# EAGLE design Saldatore (EAGLE 9.5.1)
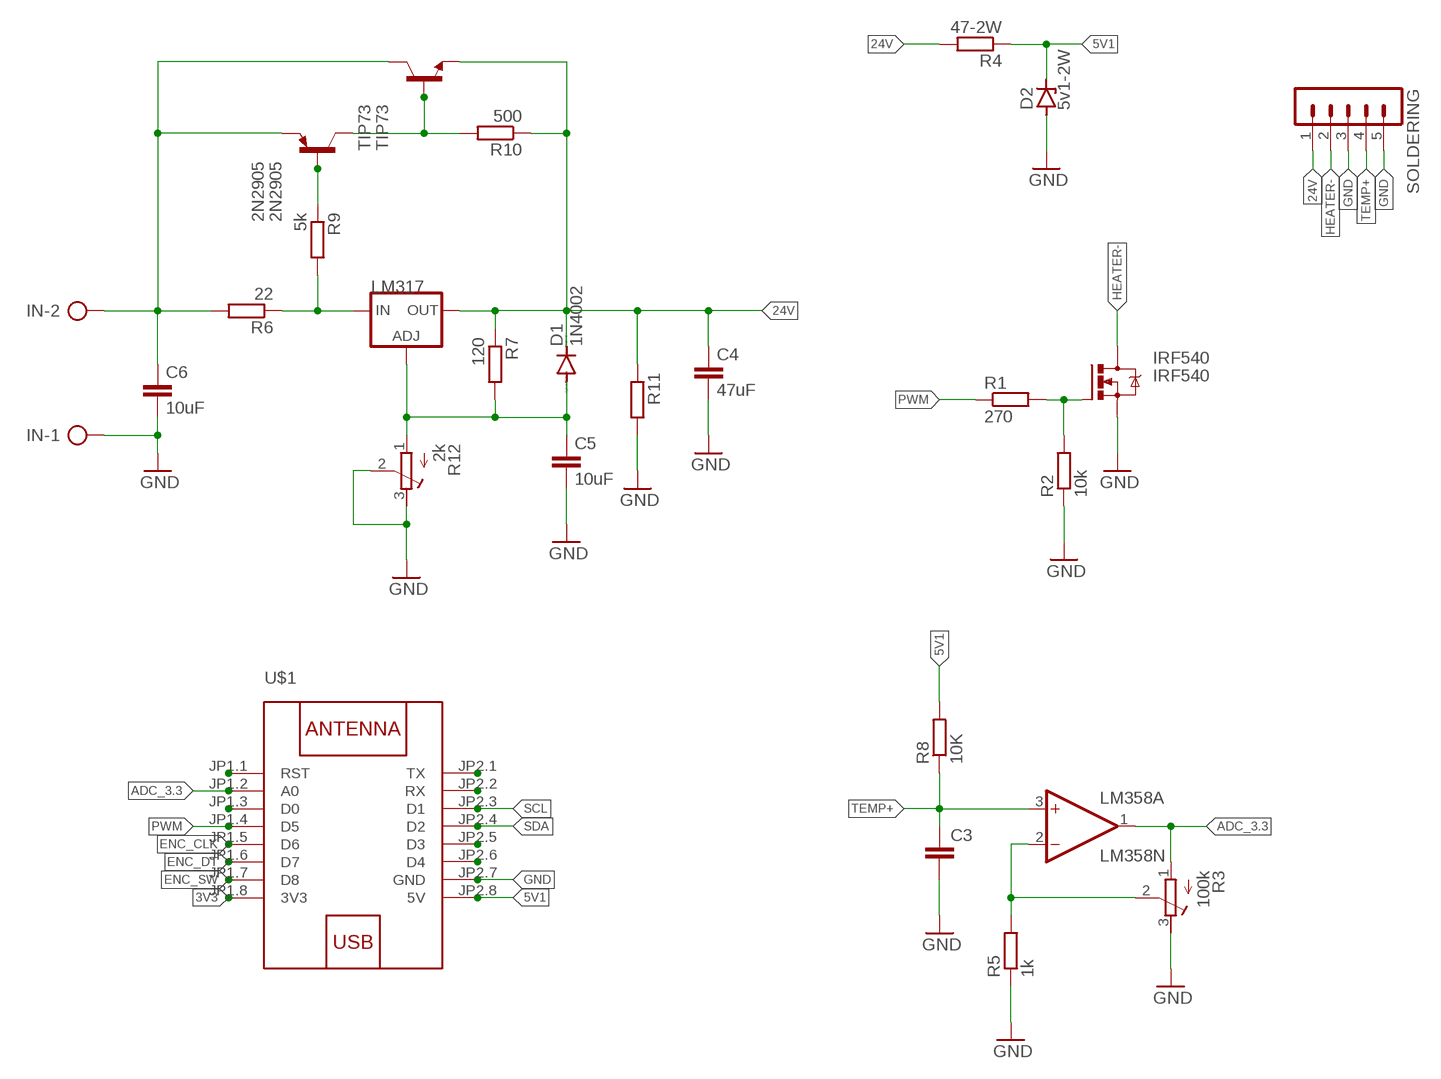
[diagram p0: schematic, sheet 1]

## Parts
2N2905  2N2905  [TO39]
C3  C-EU025-025X050  [C025-025X050]
C4  47uF  C-EU025-025X050  [C025-025X050]
C5  10uF  C-EU025-025X050  [C025-025X050]
C6  10uF  C-EU025-025X050  [C025-025X050]
D1  1N4002  1N4004DO-41  [DIOAD860W70L460D235B]
D2  5v1-2W  ZENER-DIODEDO41Z10  [DO41Z10]
IN  SMKDSP_1,5/2  [SMKDSP_1,5/2]
IRF540  IRF540  [TO220BV]
LM317  LM317TS317TS_TO220  [TO220V]
LM358  LM358N  [DIL08]
R1  270  R-EU_0204/7  [0204/7]
R2  10k  R-EU_0204/7  [0204/7]
R3  100k  R-TRIMM64W  [RTRIM64W]
R4  47-2W  R-EU_0204/7  [0204/7]
R5  1k  R-EU_0204/7  [0204/7]
R6  22  R-EU_0204/7  [0204/7]
R7  120  R-EU_0204/7  [0204/7]
R8  10K  R-EU_0204/7  [0204/7]
R9  5k  R-EU_0204/7  [0204/7]
R10  500  R-EU_0204/7  [0204/7]
R11  R-EU_0204/7  [0204/7]
R12  2k  R-TRIMM64W  [RTRIM64W]
SOLDERING  MA05-1  [MA05-1]
TIP73  TIP73  2N1613  [TO5]
U$1  WEMOS-D1-MINI  [WEMOS-D1-MINI]

## Nets
3V3: U$1.JP1.8(3V3)
5V1: D2.C R4.1 R8.2 U$1.JP2.8(5V)
24V: C4.1 D1.1(C) LM317.2(OUT) R4.2 R7.1 R10.1 R11.1 SOLDERING.1 TIP73.1(E)
ADC_3.3: LM358.1(A:OUT) R3.1(A) U$1.JP1.2(A0)
ENC_CLK: U$1.JP1.5(D6)
ENC_DT: U$1.JP1.6(D7)
ENC_SW: U$1.JP1.7(D8)
GND: C3.2 C4.2 C5.2 C6.2 D2.A IN.1 IRF540.S R2.1 R3.3(E) R5.1 R11.2 R12.2(S) R12.3(E) SOLDERING.3 SOLDERING.5 U$1.JP2.7(GND)
HEATER-: IRF540.D SOLDERING.2
N$1: IRF540.G R1.2 R2.2
N$3: LM358.2(A:-IN) R3.2(S) R5.2
N$5: LM317.3(IN) R6.1 R9.2
N$6: 2N2905.2(B) R9.1
N$7: 2N2905.3(C) R10.2 TIP73.2(B)
N$8: 2N2905.1(E) C6.1 IN.2 R6.2 TIP73.3(C)
N$9: C5.1 D1.2(A) LM317.1(ADJ) R7.2 R12.1(A)
N$11: U$1.JP2.6(D4)
N$12: U$1.JP2.5(D3)
N$15: U$1.JP2.2(RX)
N$16: U$1.JP2.1(TX)
N$17: U$1.JP1.1(RST)
N$19: U$1.JP1.3(D0)
PWM: R1.1 U$1.JP1.4(D5)
SCL: U$1.JP2.3(D1)
SDA: U$1.JP2.4(D2)
TEMP+: C3.1 LM358.3(A:+IN) R8.1 SOLDERING.4
Unconnected: LM358.5(B:+IN) LM358.6(B:-IN) LM358.7(B:OUT)

## Power pins joined to a net without a drawn wire
V+: LM358.8(P:V+)
V-: LM358.4(P:V-)

## Library data of the parts
2N2905 = transistor-pnp:2N2905*: PNP Transistror
C3-C6 = rcl:C-EU: CAPACITOR, European symbol; SPICEPREFIX: C
D1 = diode_MOD:1N4004: DIODE general purpose rectifier, 1 A
D2 = diode_MOD:ZENER-DIODE: Z-Diode
IN = con-phoenix-smkdsp:SMKDSP_1,5/2: Printklemme, Nennstrom: 17,5 A, Bemessungsspannung: 250 V, Raster: 5,0 mm Source: http://eshop.phoenixcontact.de .. 1733415.pdf; MF: FARNELL; MPN: 1733570; OC_FARNELL: 3041244; OC_NEWARK: 69C8588
IRF540 = transistor-power:IRF540: HEXFET Power MOSFET
LM317 = v-reg:LM317TS: VOLTAGE REGULATOR
LM358 = linear:LM358: OP AMP also LM158; LM258; LM2904 Source: http://cache.national.com/ds/LM/LM158.pdf
R1 R2 R4-R11 = rcl:R-EU_: RESISTOR, European symbol; SPICEPREFIX: R
R3 R12 = rcl:R-TRIMM: Trimm resistor; SPICEMODEL: X; SPICEPREFIXL: POT
SOLDERING = con-lstb:MA05-1: PIN HEADER; OC_FARNELL: unknown; OC_NEWARK: unknown
TIP73 = transistor:2N1613: NPN TRANSISTOR
U$1 = diy-modules:WEMOS-D1-MINI: WEMOS D1 mini: Mini Wi-Fi Board based on ESP-8266 device More details can be found here: https://www.wemos.cc/product/d1-mini.html Click here to find device on ebay.com <http://www.ebay.com/sch/wemos+d1+mini+nodemcu>

## Board
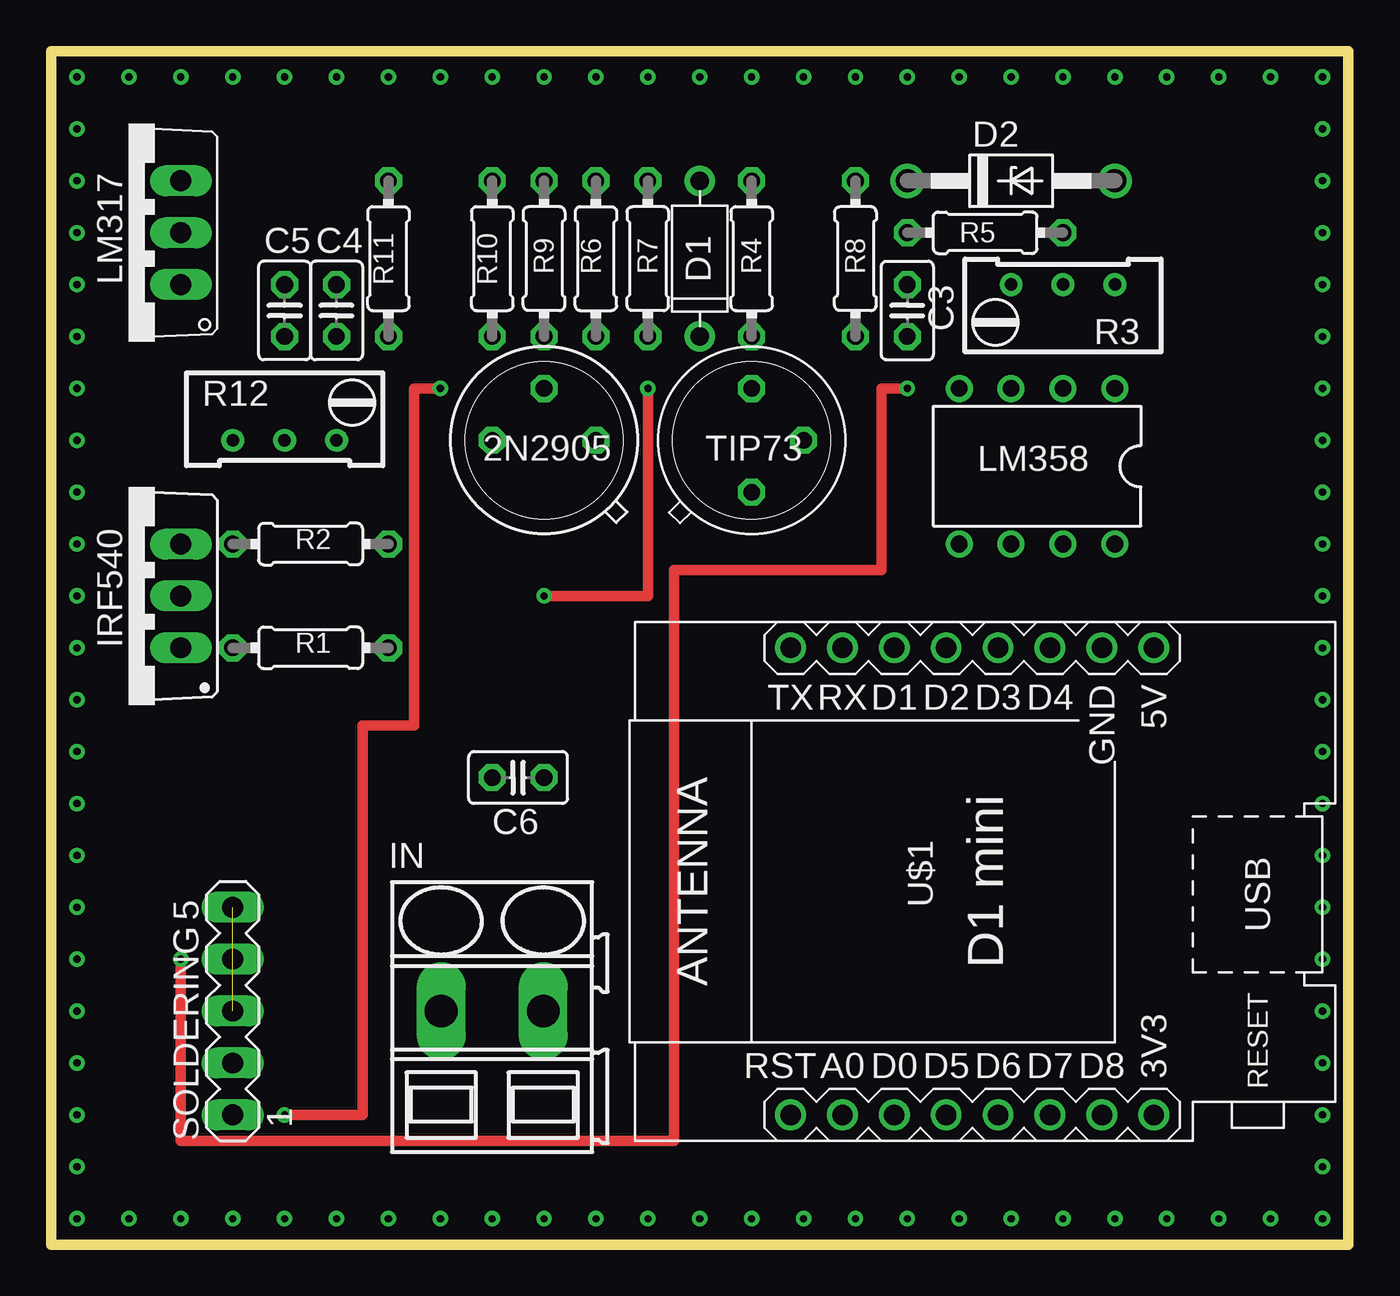
[diagram p1: board, top side]
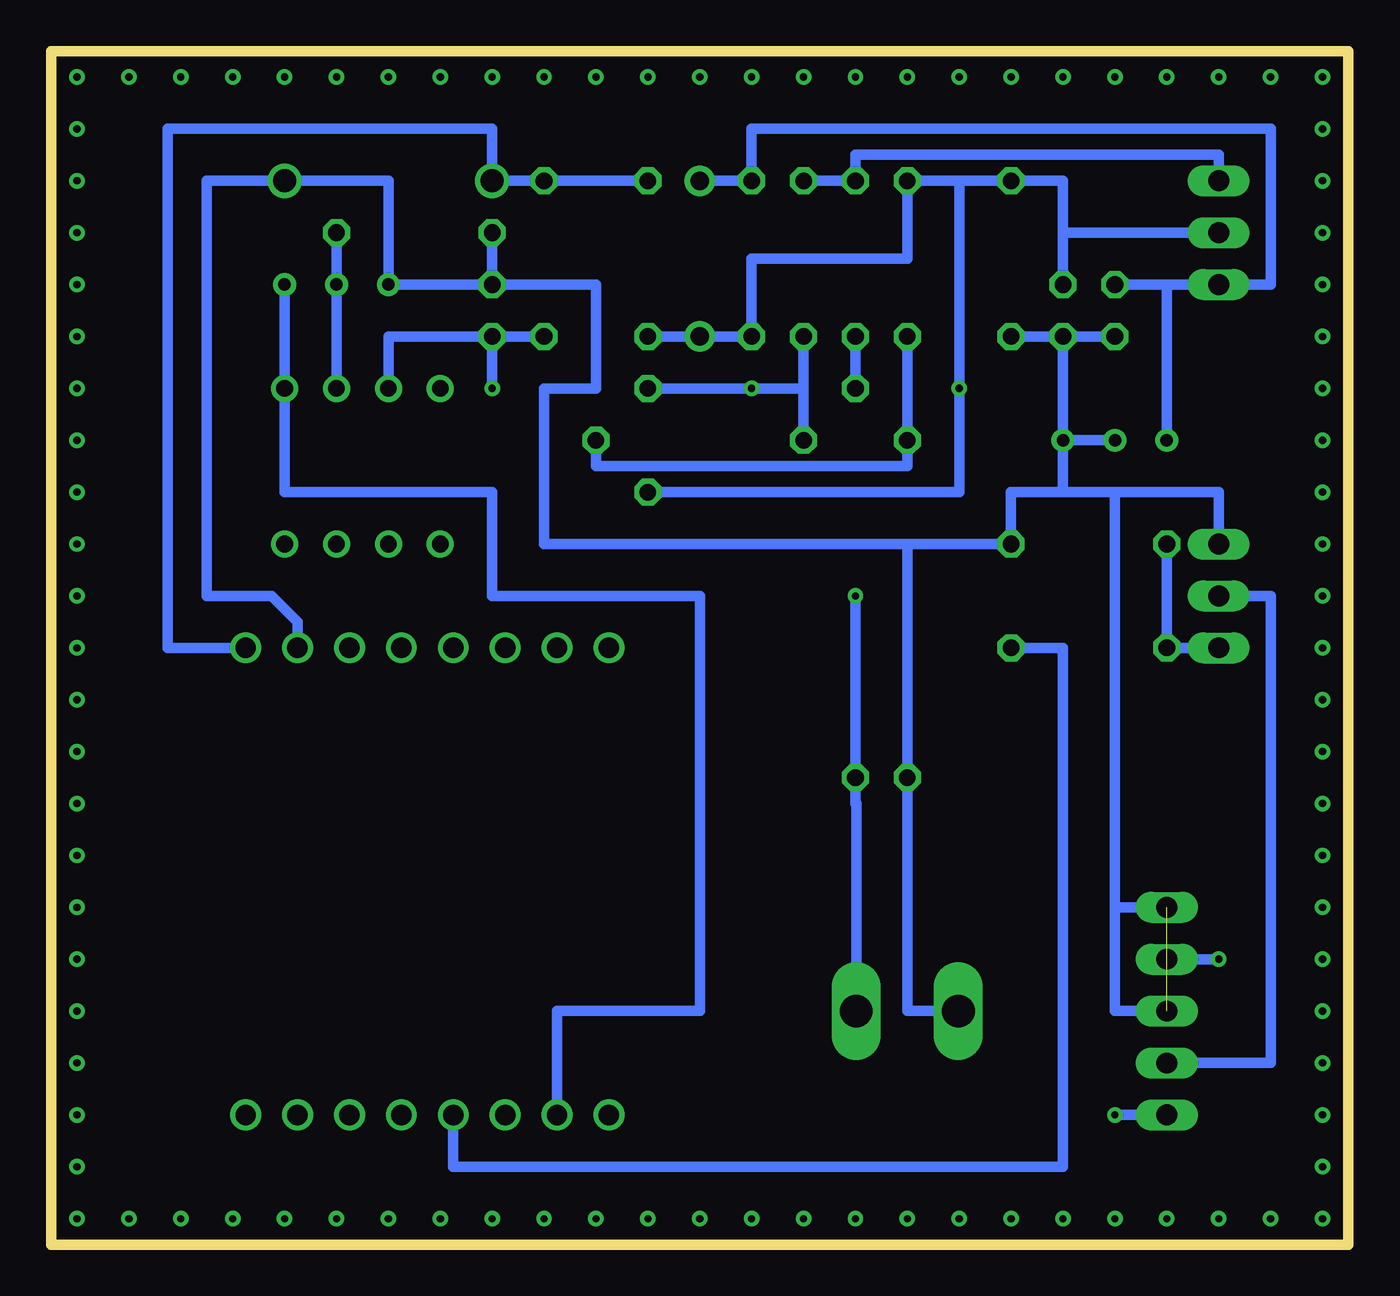
[diagram p2: board, bottom side, seen from below]

Size 63.5 x 58.42 mm. Coordinates in mm from the lower left corner, seen from the top.
Outline: 0,58.42 63.5,58.42 63.5,0 0,0 0,58.42
Copper layers (1*16): Top 0.035mm / dielectric 1.5mm / Bottom 0.035mm
Design rules "default": minimum track width 6mil, minimum drill 0.35mm, track to track 6mil, track to pad 6mil, pad to pad 6mil, via to via 6mil, smd to smd 6mil, copper to edge 40mil, drill to drill 6mil, minimum pad ring 10mil, minimum via ring 8mil, stop-mask expansion 4mil, vias tented up to drill 0mil, thermal gap 10mil

### Footprints (pad centres in the part's own frame; a part is rotated, then mirrored left to right if it is on the bottom)
TO39 = drill 0.813 octagon: 1 0,-2.54; 2 2.54,0; 3 0,2.54
C025-025X050 = drill 0.813 octagon: 1 -1.27,0; 2 1.27,0
DIOAD860W70L460D235B = drill 0.9 pad 1.5: 1 -3.81,0; 2 3.81,0
DO41Z10 = drill 1.118: A 5.08,0; C -5.08,0
SMKDSP_1,5/2 = drill 1.6 pad 1.8 long: 1 -2.5,0; 2 2.5,0
TO220BV = drill 1.016 long: D 0,-2.54; G -2.54,-2.54; S 2.54,-2.54
TO220V = drill 1.016 long: 1 -2.54,-2.54; 2 0,-2.54; 3 2.54,-2.54
DIL08 = drill 0.813 pad 1.27: 1 -3.81,-3.81; 2 -1.27,-3.81; 3 1.27,-3.81; 4 3.81,-3.81; 5 3.81,3.81; 6 1.27,3.81; 7 -1.27,3.81; 8 -3.81,3.81
0204/7 = drill 0.813 octagon: 1 -3.81,0; 2 3.81,0
RTRIM64W = drill 0.61: 1 1.27,-2.54; 2 1.27,0; 3 1.27,2.54
MA05-1 = drill 1.016 long: 1 -5.08,0; 2 -2.54,0; 3 0,0; 4 2.54,0; 5 5.08,0
TO5 = drill 0.813 octagon: 1 0,-2.54; 2 2.54,0; 3 0,2.54
WEMOS-D1-MINI = drill 1: JP1.1 -11.43,9.525; JP1.2 -11.43,6.985; JP1.3 -11.43,4.445; JP1.4 -11.43,1.905; JP1.5 -11.43,-0.635; JP1.6 -11.43,-3.175; JP1.7 -11.43,-5.715; JP1.8 -11.43,-8.255; JP2.1 11.43,9.525; JP2.2 11.43,6.985; JP2.3 11.43,4.445; JP2.4 11.43,1.905; JP2.5 11.43,-0.635; JP2.6 11.43,-3.175; JP2.7 11.43,-5.715; JP2.8 11.43,-8.255

### Placement (x,y rotation side)
2N2905  24.13,39.37 90 top
C3  41.91,45.72 90 top
C4  13.97,45.72 270 top
C5  11.43,45.72 270 top
C6  22.86,22.86 180 top
D1  31.75,48.26 90 top
D2  46.99,52.07 0 top
IN  21.59,11.43 0 top
IRF540  3.81,31.75 90 top
LM317  3.81,49.53 90 top
LM358  48.26,38.1 180 top
R1  12.7,29.21 180 top
R2  12.7,34.29 180 top
R3  49.53,45.72 90 top
R4  34.29,48.26 270 top
R5  45.72,49.53 0 top
R6  26.67,48.26 270 top
R7  29.21,48.26 90 top
R8  39.37,48.26 90 top
R9  24.13,48.26 90 top
R10  21.59,48.26 270 top
R11  16.51,48.26 270 top
R12  11.43,40.64 270 top
SOLDERING  8.89,11.43 90 top
TIP73  34.29,39.37 0 top
U$1  45.72,17.78 90 top

### Tracks (layer width: path | path; a pad name or v marks a point on that pad's centre or on a via)
5V1
  Bottom 0.508: R4.1 R8.2 D2.C 41.91,54.61 57.79,54.61 57.79,29.21 U$1.JP2.8
24V  (via drill 0.35)
  Top 0.508: v11.43,6.35 15.24,6.35 15.24,25.4 17.78,25.4 17.78,41.91 v19.05,41.91
  Bottom 0.508: 19.05,52.07 R10.1 21.59,48.26 29.21,48.26 R7.1 D1.1 R4.2 | 19.05,52.07 R11.1 13.97,52.07 13.97,49.53 | C4.1 13.97,49.53 | LM317.2 13.97,49.53 | 19.05,52.07 v19.05,41.91 19.05,36.83 TIP73.1 | v11.43,6.35 SOLDERING.1
ADC_3.3
  Bottom 0.508: R3.1 LM358.1 52.07,36.83 41.91,36.83 41.91,31.75 31.75,31.75 31.75,11.43 38.73,11.43 U$1.JP1.2
GND  (1 unrouted)
  Bottom 0.508: C3.2 R3.3 46.99,52.07 D2.A 55.88,52.07 55.88,31.75 52.7,31.75 51.44,30.48 U$1.JP2.7 | C3.2 R5.1 | 13.97,36.83 16.51,36.83 R2.1 21.59,34.29 | 13.97,36.83 11.43,36.83 | 11.43,36.83 6.35,36.83 IRF540.S | 19.05,11.43 IN.1 21.59,11.43 C6.2 21.59,34.29 | C5.2 C4.2 | C4.2 R11.2 | 21.59,34.29 39.37,34.29 39.37,41.91 36.83,41.91 36.83,46.99 C3.2 | SOLDERING.3 11.43,11.43 11.43,36.83 | SOLDERING.5 11.43,16.51 | R12.2 R12.3 | R12.3 C4.2 | R12.3 13.97,36.83
HEATER-
  Bottom 0.508: IRF540.D 3.81,31.75 3.81,8.89 SOLDERING.2
N$1
  Bottom 0.508: IRF540.G R1.2 R2.2
N$2  (via drill 0.35)
  other vias: 1.27,52.07
N$3
  Bottom 0.508: LM358.2 R3.2 R5.2
N$4  (via drill 0.35)
  other vias: 1.27,49.53
N$5
  Bottom 0.508: R6.1 R9.2 24.13,53.34 6.35,53.34 LM317.3
N$6
  Bottom 0.508: R9.1 2N2905.2
N$7
  Bottom 0.508: R10.2 2N2905.3 21.59,38.1 36.83,38.1 TIP73.2
N$8  (via drill 0.35)
  Top 0.508: v29.21,41.91 29.21,31.75 v24.13,31.75
  Bottom 0.508: IN.2 24.09,21.59 24.13,21.59 C6.1 v24.13,31.75 | 2N2905.1 26.67,41.91 | 26.67,41.91 R6.2 | TIP73.3 v29.21,41.91 26.67,41.91
N$9
  Bottom 0.508: D1.2 R7.2 29.21,54.61 3.81,54.61 3.81,46.99 LM317.1 8.89,46.99 | 8.89,46.99 C5.1 | R12.1 8.89,46.99
N$10  (via drill 0.35)
  other vias: 1.27,46.99
N$13  (via drill 0.35)
  other vias: 1.27,44.45
N$14  (via drill 0.35)
  other vias: 1.27,41.91
N$18  (via drill 0.35)
  other vias: 1.27,39.37
N$20  (via drill 0.35)
  other vias: 1.27,36.83
N$21  (via drill 0.35)
  other vias: 1.27,34.29
N$22  (via drill 0.35)
  other vias: 1.27,31.75
N$23  (via drill 0.35)
  other vias: 1.27,29.21
N$24  (via drill 0.35)
  other vias: 1.27,26.67
N$25  (via drill 0.35)
  other vias: 1.27,24.13
N$26  (via drill 0.35)
  other vias: 1.27,21.59
N$27  (via drill 0.35)
  other vias: 1.27,19.05
N$28  (via drill 0.35)
  other vias: 1.27,16.51
N$30  (via drill 0.35)
  other vias: 1.27,13.97
N$31  (via drill 0.35)
  other vias: 1.27,11.43
N$32  (via drill 0.35)
  other vias: 1.27,8.89
N$33  (via drill 0.35)
  other vias: 1.27,6.35
N$34  (via drill 0.35)
  other vias: 1.27,3.81
N$35  (via drill 0.35)
  other vias: 1.27,1.27
N$36  (via drill 0.35)
  other vias: 3.81,1.27
N$38  (via drill 0.35)
  other vias: 6.35,1.27
N$39  (via drill 0.35)
  other vias: 8.89,1.27
N$40  (via drill 0.35)
  other vias: 11.43,1.27
N$41  (via drill 0.35)
  other vias: 13.97,1.27
N$42  (via drill 0.35)
  other vias: 16.51,1.27
N$43  (via drill 0.35)
  other vias: 19.05,1.27
N$44  (via drill 0.35)
  other vias: 21.59,1.27
N$45  (via drill 0.35)
  other vias: 24.13,1.27
N$46  (via drill 0.35)
  other vias: 26.67,1.27
N$47  (via drill 0.35)
  other vias: 29.21,1.27
N$48  (via drill 0.35)
  other vias: 31.75,1.27
N$49  (via drill 0.35)
  other vias: 34.29,1.27
N$50  (via drill 0.35)
  other vias: 36.83,1.27
N$51  (via drill 0.35)
  other vias: 39.37,1.27
N$52  (via drill 0.35)
  other vias: 41.91,1.27
N$53  (via drill 0.35)
  other vias: 44.45,1.27
N$54  (via drill 0.35)
  other vias: 46.99,1.27
N$55  (via drill 0.35)
  other vias: 49.53,1.27
N$56  (via drill 0.35)
  other vias: 52.07,1.27
N$57  (via drill 0.35)
  other vias: 54.61,1.27
N$58  (via drill 0.35)
  other vias: 57.15,1.27
N$59  (via drill 0.35)
  other vias: 59.69,1.27
N$62  (via drill 0.35)
  other vias: 62.23,1.27
N$63  (via drill 0.35)
  other vias: 62.23,3.81
N$64  (via drill 0.35)
  other vias: 62.23,6.35
N$65  (via drill 0.35)
  other vias: 62.23,8.89
N$66  (via drill 0.35)
  other vias: 62.23,11.43
N$67  (via drill 0.35)
  other vias: 62.23,13.97
N$68  (via drill 0.35)
  other vias: 62.23,16.51
N$69  (via drill 0.35)
  other vias: 62.23,19.05
N$70  (via drill 0.35)
  other vias: 62.23,21.59
N$71  (via drill 0.35)
  other vias: 62.23,24.13
N$72  (via drill 0.35)
  other vias: 62.23,26.67
N$73  (via drill 0.35)
  other vias: 62.23,29.21
N$74  (via drill 0.35)
  other vias: 62.23,31.75
N$75  (via drill 0.35)
  other vias: 62.23,34.29
N$76  (via drill 0.35)
  other vias: 62.23,36.83
N$77  (via drill 0.35)
  other vias: 62.23,39.37
N$78  (via drill 0.35)
  other vias: 62.23,41.91
N$79  (via drill 0.35)
  other vias: 62.23,44.45
N$80  (via drill 0.35)
  other vias: 62.23,46.99
N$81  (via drill 0.35)
  other vias: 62.23,49.53
N$82  (via drill 0.35)
  other vias: 62.23,52.07
N$83  (via drill 0.35)
  other vias: 62.23,54.61
N$84  (via drill 0.35)
  other vias: 62.23,57.15
N$85  (via drill 0.35)
  other vias: 59.69,57.15
N$86  (via drill 0.35)
  other vias: 57.15,57.15
N$87  (via drill 0.35)
  other vias: 54.61,57.15
N$88  (via drill 0.35)
  other vias: 52.07,57.15
N$89  (via drill 0.35)
  other vias: 49.53,57.15
N$90  (via drill 0.35)
  other vias: 46.99,57.15
N$91  (via drill 0.35)
  other vias: 44.45,57.15
N$92  (via drill 0.35)
  other vias: 41.91,57.15
N$93  (via drill 0.35)
  other vias: 39.37,57.15
N$94  (via drill 0.35)
  other vias: 36.83,57.15
N$95  (via drill 0.35)
  other vias: 34.29,57.15
N$96  (via drill 0.35)
  other vias: 31.75,57.15
N$97  (via drill 0.35)
  other vias: 29.21,57.15
N$98  (via drill 0.35)
  other vias: 26.67,57.15
N$99  (via drill 0.35)
  other vias: 24.13,57.15
N$100  (via drill 0.35)
  other vias: 21.59,57.15
N$101  (via drill 0.35)
  other vias: 19.05,57.15
N$102  (via drill 0.35)
  other vias: 16.51,57.15
N$103  (via drill 0.35)
  other vias: 13.97,57.15
N$104  (via drill 0.35)
  other vias: 11.43,57.15
N$105  (via drill 0.35)
  other vias: 8.89,57.15
N$106  (via drill 0.35)
  other vias: 6.35,57.15
N$107  (via drill 0.35)
  other vias: 3.81,57.15
N$108  (via drill 0.35)
  other vias: 1.27,57.15
N$109  (via drill 0.35)
  other vias: 1.27,54.61
PWM
  Bottom 0.508: U$1.JP1.4 43.81,3.81 13.97,3.81 13.97,29.21 R1.1
TEMP+  (via drill 0.35)
  Top 0.508: v6.35,13.97 6.35,5.08 30.48,5.08 30.48,33.02 40.64,33.02 40.64,41.91 v41.91,41.91
  Bottom 0.508: LM358.3 46.99,44.45 C3.1 | C3.1 R8.1 | C3.1 v41.91,41.91 | SOLDERING.4 v6.35,13.97